# EAGLE design sensor_board (EAGLE 7.2.0)
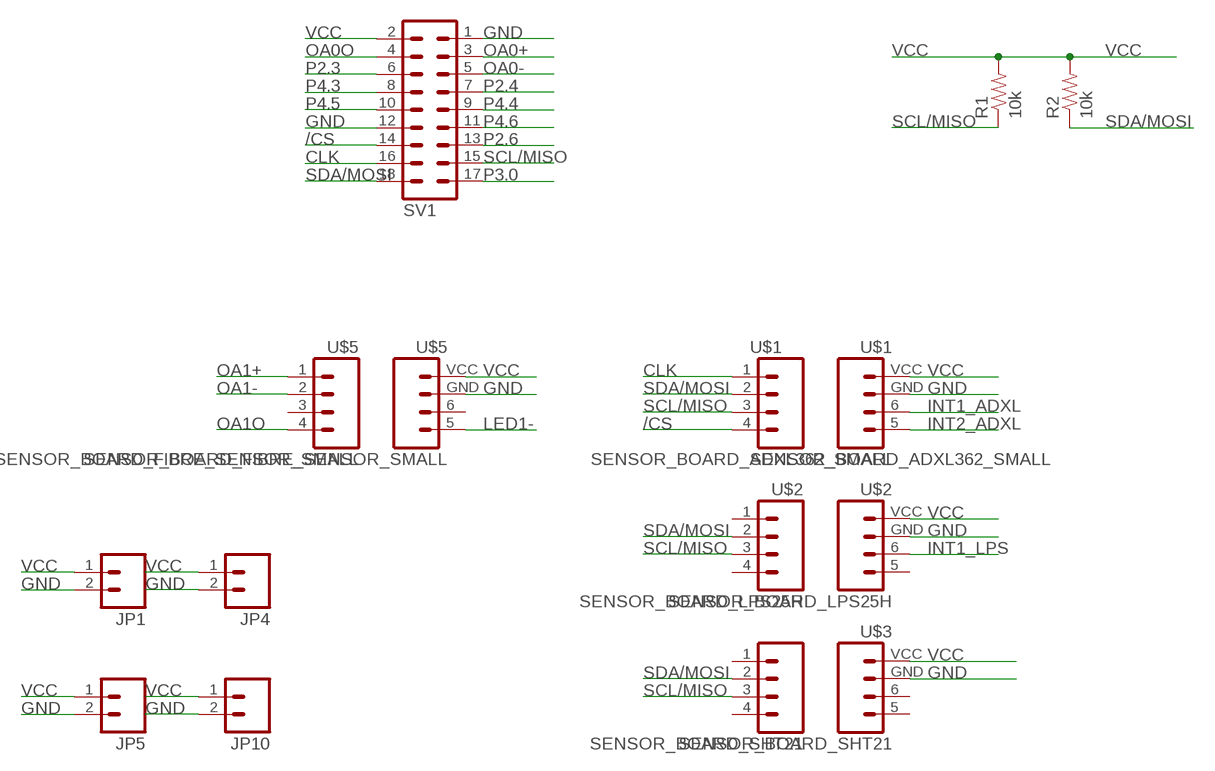
[diagram p0: schematic, sheet 1]

## Parts
JP1  M02PTH  [1X02]
JP4  M02PTH  [1X02]
JP5  M02PTH  [1X02]
JP10  M02PTH  [1X02]
R1  10k  10KOHM-1/4W-1%(PTH)HORIZ  [AXIAL-0.3]
R2  10k  10KOHM-1/4W-1%(PTH)HORIZ  [AXIAL-0.3]
SV1  MA09-2  [MA09-2]
U$1  SENSOR_BOARD_ADXL362_SMALL  [SENSOR_BOARD_GEN_SMALL]
U$2  SENSOR_BOARD_LPS25H  [SENSOR_BOARD_GEN]
U$3  SENSOR_BOARD_SHT21  [SENSOR_BOARD_GEN]
U$5  SENSOR_BOARD_FIBRE_SENSOR_SMALL  [SENSOR_BOARD_GEN_SMALL]

## Nets
/CS: SV1.14 U$1.4(/CS)
CLK: SV1.16 U$1.1(CLK)
GND: JP1.2 JP4.2 JP5.2 JP10.2 SV1.1 SV1.12 U$1.GND U$2.GND U$3.GND U$5.GND
INT1_ADXL: U$1.6(INT1)
INT1_LPS: U$2.6(INT1)
INT2_ADXL: U$1.5(INT2)
LED1-: U$5.5(LED-)
OA0+: SV1.3
OA0-: SV1.5
OA0O: SV1.4
OA1+: U$5.1(OA+)
OA1-: U$5.2(OA-)
OA1O: U$5.4(OAO)
P2.3: SV1.6
P2.4: SV1.7
P2.6: SV1.13
P3.0: SV1.17
P4.3: SV1.8
P4.4: SV1.9
P4.5: SV1.10
P4.6: SV1.11
SCL/MISO: R1.P$1 SV1.15 U$1.3(MISO) U$2.3(SCL) U$3.3(SCL)
SDA/MOSI: R2.P$1 SV1.18 U$1.2(MOSI) U$2.2(SDA) U$3.2(SDA)
VCC: JP1.1 JP4.1 JP5.1 JP10.1 R1.P$2 R2.P$2 SV1.2 U$1.VCC U$2.VCC U$3.VCC U$5.VCC
Unconnected: U$2.1 U$2.4 U$2.5 U$3.1 U$3.4 U$3.5 U$3.6 U$5.3 U$5.6

## Library data of the parts
JP1 JP4 JP5 JP10 = SparkFun-Connectors:M02: Standard 2-pin 0.1" header. Use with - straight break away headers ( PRT-00116) - right angle break away headers (PRT-00553) - swiss pins (PRT-00743) - machine pins (PRT-00117) - female headers (PRT-00115) Molex polarized connector foot print use with: PRT-08233 with associated crimp pins and housings. 2.54_SCREWTERM for use with PRT-10571. 3.5mm Screw Terminal footprints for PRT-08084 5mm Screw Terminal footprints for use with PRT-08432
R1 R2 = SparkFun-Resistors:10KOHM-1/4W-1%(PTH): RES-12183; PROD_ID: RES-12183
SV1 = bq25570_board:MA09-2: PIN HEADER; OC_FARNELL: unknown; OC_NEWARK: unknown
U$1 = sensors:SENSOR_BOARD_ADXL362
U$2 = sensors:SENSOR_BOARD_LPS25H
U$3 = sensors:SENSOR_BOARD_SHT21
U$5 = sensors:SENSOR_BOARD_FIBRE_SENSOR

## Board
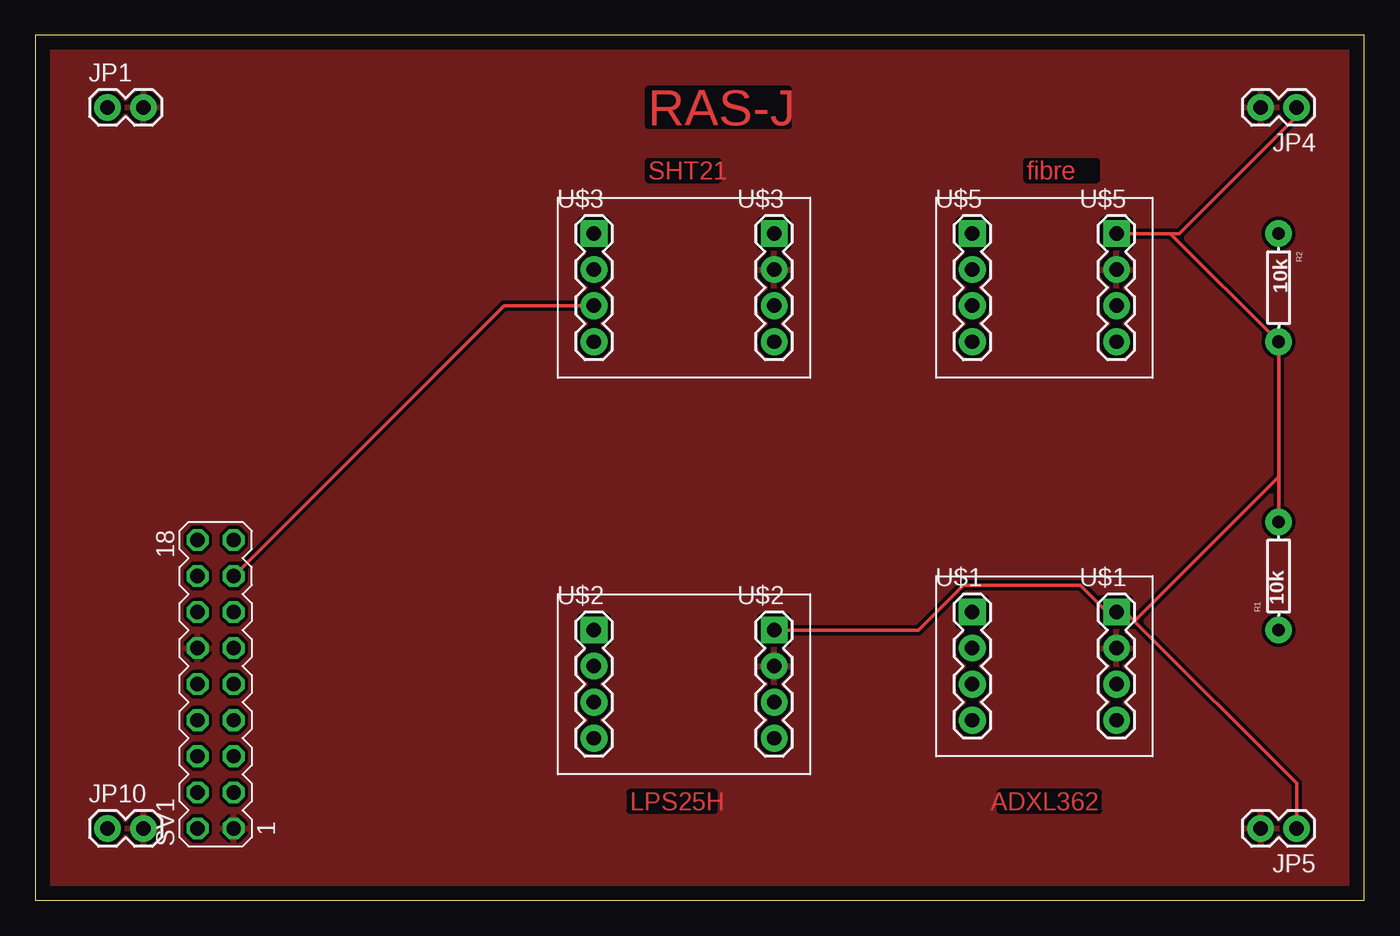
[diagram p1: board, top side]
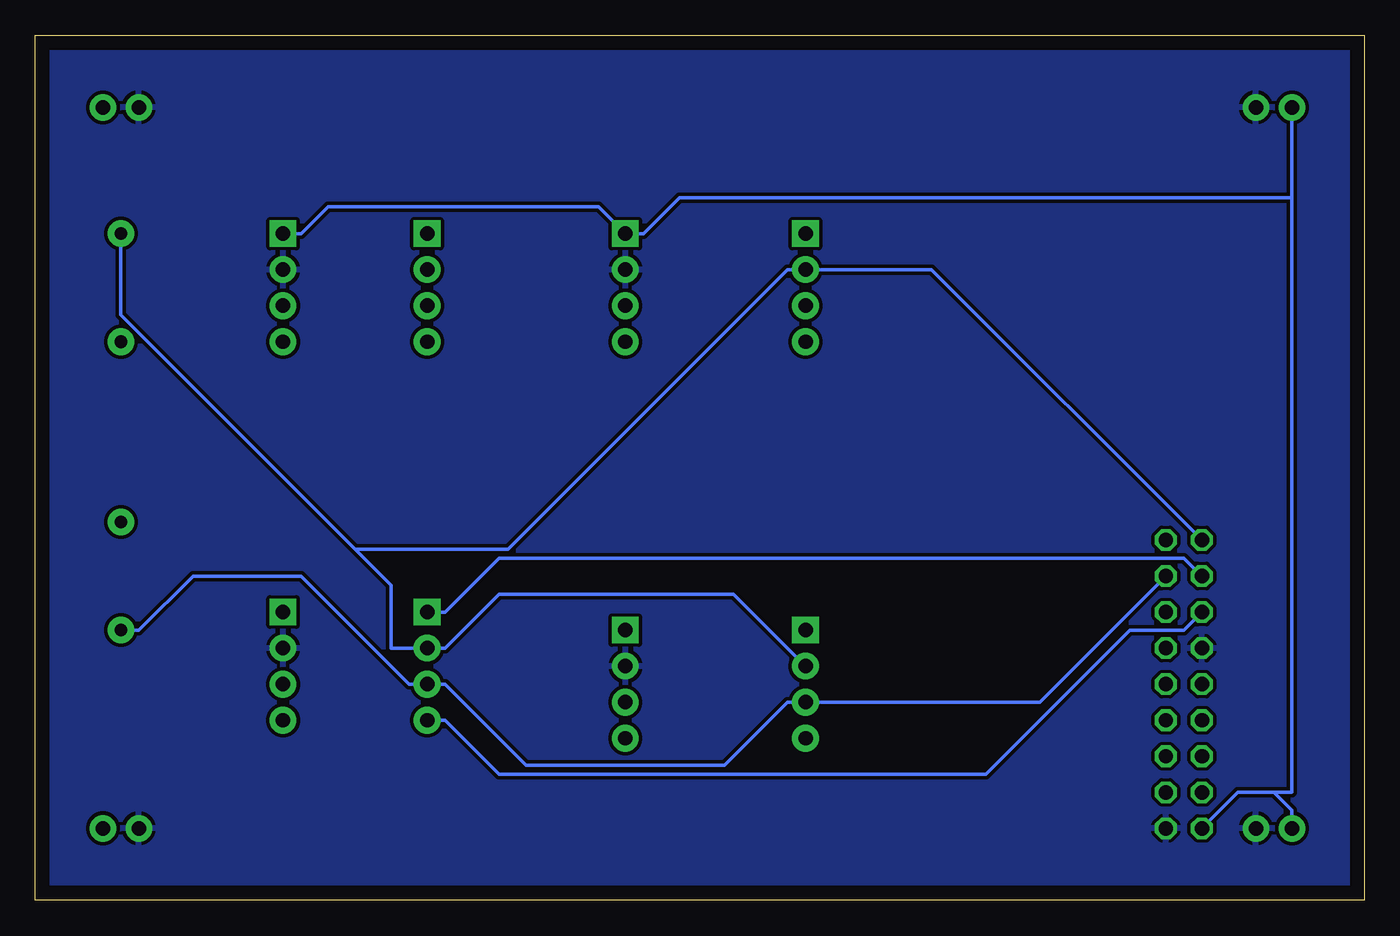
[diagram p2: board, bottom side, seen from below]

Size 93.65 x 60.95 mm. Coordinates in mm from the lower left corner, seen from the top.
Outline: 0,0 93.65,0 93.65,60.95 0,60.95 0,0
Copper layers (1*16): Top 0.035mm / dielectric 1.5mm / Bottom 0.035mm
Design rules "UoM_design_rules": minimum track width 0.25mm, minimum drill 0.3mm, track to track 0.25mm, track to pad 0.25mm, pad to pad 0.25mm, via to via 0.25mm, smd to smd 8mil, copper to edge 40mil, drill to drill 8mil, minimum pad ring 10mil, minimum via ring 8mil, stop-mask expansion 4mil, vias tented up to drill 0mil, thermal gap 10mil

### Footprints (pad centres in the part's own frame; a part is rotated, then mirrored left to right if it is on the bottom)
1X02 = drill 1.016 pad 1.88: 1 0,0; 2 2.54,0
AXIAL-0.3 = drill 0.9 pad 1.88: P$1 -3.81,0; P$2 3.81,0
MA09-2 = drill 1.016 octagon: 1 -10.16,-1.27; 2 -10.16,1.27; 3 -7.62,-1.27; 4 -7.62,1.27; 5 -5.08,-1.27; 6 -5.08,1.27; 7 -2.54,-1.27; 8 -2.54,1.27; 9 0,-1.27; 10 0,1.27; 11 2.54,-1.27; 12 2.54,1.27; 13 5.08,-1.27; 14 5.08,1.27; 15 7.62,-1.27; 16 7.62,1.27; 17 10.16,-1.27; 18 10.16,1.27
SENSOR_BOARD_GEN_SMALL = drill 1.016 pad 1.88 square: 1 2.54,10.16; VCC 12.7,10.16 | drill 1.016 pad 1.88: 2 2.54,7.62; 3 2.54,5.08; 4 2.54,2.54; 5 12.7,2.54; 6 12.7,5.08; GND 12.7,7.62
SENSOR_BOARD_GEN = drill 1.016 pad 1.88 square: 1 2.54,10.16; VCC 15.24,10.16 | drill 1.016 pad 1.88: 2 2.54,7.62; 3 2.54,5.08; 4 2.54,2.54; 5 15.24,2.54; 6 15.24,5.08; GND 15.24,7.62

### Placement (x,y rotation side)
JP1  5.08,55.88 0 top
JP4  88.9,55.88 180 top
JP5  88.9,5.08 180 top
JP10  5.08,5.08 0 top
R1  87.63,22.86 90 top
R2  87.63,43.18 270 top
SV1  12.7,15.24 90 top
U$1  63.5,10.16 0 top
U$2  36.83,8.89 0 top
U$3  36.83,36.83 0 top
U$5  63.5,36.83 0 top

### Tracks (layer width: path | path; a pad name or v marks a point on that pad's centre or on a via)
/CS
  Bottom 0.25: SV1.14 12.7,19.05 16.51,19.05 26.67,8.89 60.96,8.89 64.77,12.7 U$1.4
CLK
  Bottom 0.25: SV1.16 12.7,24.13 60.96,24.13 64.77,20.32 U$1.1
GND
  pour Bottom: 0,60.96 95.25,60.96 95.25,0 0,0
  pour Top: 0,60.96 95.25,60.96 95.25,0 0,0
SCL/MISO
  Top 0.25: U$3.3 33.02,41.91 SV1.15
  Bottom 0.25: R1.P$1 86.36,19.05 82.55,22.86 74.93,22.86 67.31,15.24 U$1.3 64.77,15.24 59.05,9.53 45.09,9.53 40.64,13.97 U$2.3 22.86,13.97 SV1.15
SDA/MOSI
  Bottom 0.25: SV1.18 30.48,44.45 U$3.2 40.64,44.45 60.33,24.77 71.12,24.77 | U$2.2 44.45,21.59 60.96,21.59 64.77,17.78 U$1.2 68.58,17.78 68.58,22.23 71.12,24.77 | R2.P$1 87.63,41.27 71.12,24.77
VCC
  Top 0.25: U$2.VCC 62.23,19.05 65.41,22.23 73.66,22.23 75.56,20.32 U$1.VCC 76.83,20.32 77.47,19.68 | JP5.1 88.9,8.26 77.47,19.68 | 87.63,29.84 R2.P$2 80.01,46.99 | 87.63,29.84 R1.P$2 | JP4.1 88.9,55.24 80.64,46.99 80.01,46.99 | U$5.VCC 80.01,46.99 | 87.63,29.84 77.47,19.68
  Bottom 0.25: SV1.2 8.89,7.62 6.35,7.62 | 6.35,7.62 5.08,6.35 JP10.1 | 5.08,49.53 5.08,7.62 6.35,7.62 | 5.08,49.53 JP1.1 | U$5.VCC 74.93,46.99 73.03,48.9 53.98,48.9 U$3.VCC 50.8,46.99 48.26,49.53 5.08,49.53

### Text on the board
Top: RAS-J | SHT21 | fibre | ADXL362 | LPS25H